# EAGLE schematic frets-analog (EAGLE 6.6.0)
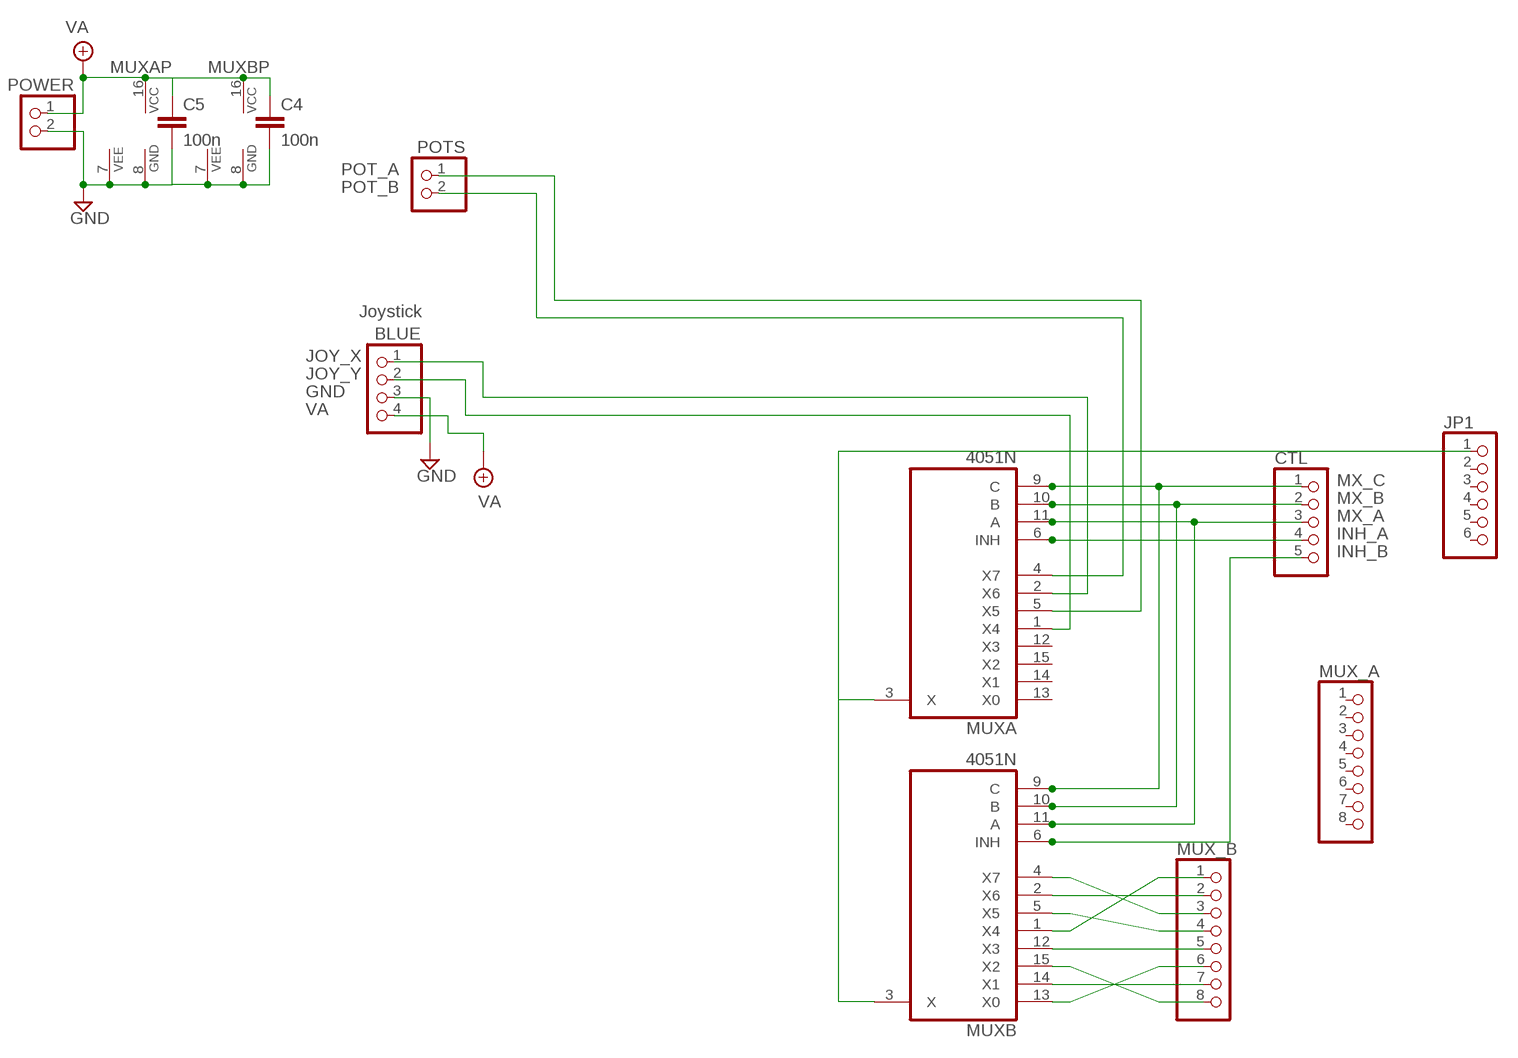
[diagram p0: schematic, sheet 1]

## Parts
BLUE  PINHD-1X4  [1X04]
C4  100n  050X030_050  [050X030_050_3]
C5  100n  050X030_050  [050X030_050_3]
CTL  PINHD-1X5  [1X05]
JP1  PINHD-1X6  [1X06]
MUX_A  PINHD-1X8  [1X08]
MUX_B  PINHD-1X8  [1X08]
MUXA  4051N  [DIL16]
MUXB  4051N  [DIL16]
POTS  PINHD-1X2  [1X02]
POWER  PINHD-1X2  [1X02]

## Nets
GND: BLUE.3 C4.2 C5.2 MUXA.7(VEE) MUXA.8(GND) MUXB.7(VEE) MUXB.8(GND) POWER.2
INH_A: CTL.4 MUXA.6(INH)
INH_B: CTL.5 MUXB.6(INH)
JOY_X: BLUE.1 MUXA.2(X6)
JOY_Y: BLUE.2 MUXA.1(X4)
MX_A: CTL.3 MUXA.11(A) MUXB.11(A)
MX_B: CTL.2 MUXA.10(B) MUXB.10(B)
MX_C: CTL.1 MUXA.9(C) MUXB.9(C)
N$1: JP1.1 MUXA.3(X) MUXB.3(X)
N$2: MUX_B.1 MUXB.1(X4)
N$3: MUX_B.2 MUXB.2(X6)
N$4: MUX_B.3 MUXB.4(X7)
N$5: MUX_B.4 MUXB.5(X5)
N$6: MUX_B.5 MUXB.12(X3)
N$7: MUX_B.6 MUXB.13(X0)
N$8: MUX_B.7 MUXB.14(X1)
N$9: MUX_B.8 MUXB.15(X2)
POT_A: MUXA.5(X5) POTS.1
POT_B: MUXA.4(X7) POTS.2
VA: BLUE.4 C4.1 C5.1 MUXA.16(VCC) MUXB.16(VCC) POWER.1
Unconnected: JP1.2 JP1.3 JP1.4 JP1.5 JP1.6 MUX_A.1 MUX_A.2 MUX_A.3 MUX_A.4 MUX_A.5 MUX_A.6 MUX_A.7 MUX_A.8 MUXA.12(X3) MUXA.13(X0) MUXA.14(X1) MUXA.15(X2)

## Notes on the sheet
- Joystick

## Library data of the parts
BLUE = pinhead:PINHD-1X4: PIN HEADER
C4 C5 = gm-caps-ceramic:050X030_050: 120 - 150pF Xicon Ceramic Disc 5mm lead spacing
CTL = pinhead:PINHD-1X5: PIN HEADER
JP1 = pinhead:PINHD-1X6: PIN HEADER
MUX_A MUX_B = pinhead:PINHD-1X8: PIN HEADER
MUXA MUXB = 40xx:4051: 8-channel ANALOG MULTIPLEXER
POTS POWER = pinhead:PINHD-1X2: PIN HEADER